# EAGLE schematic CoreExpansion (EAGLE 5.06)
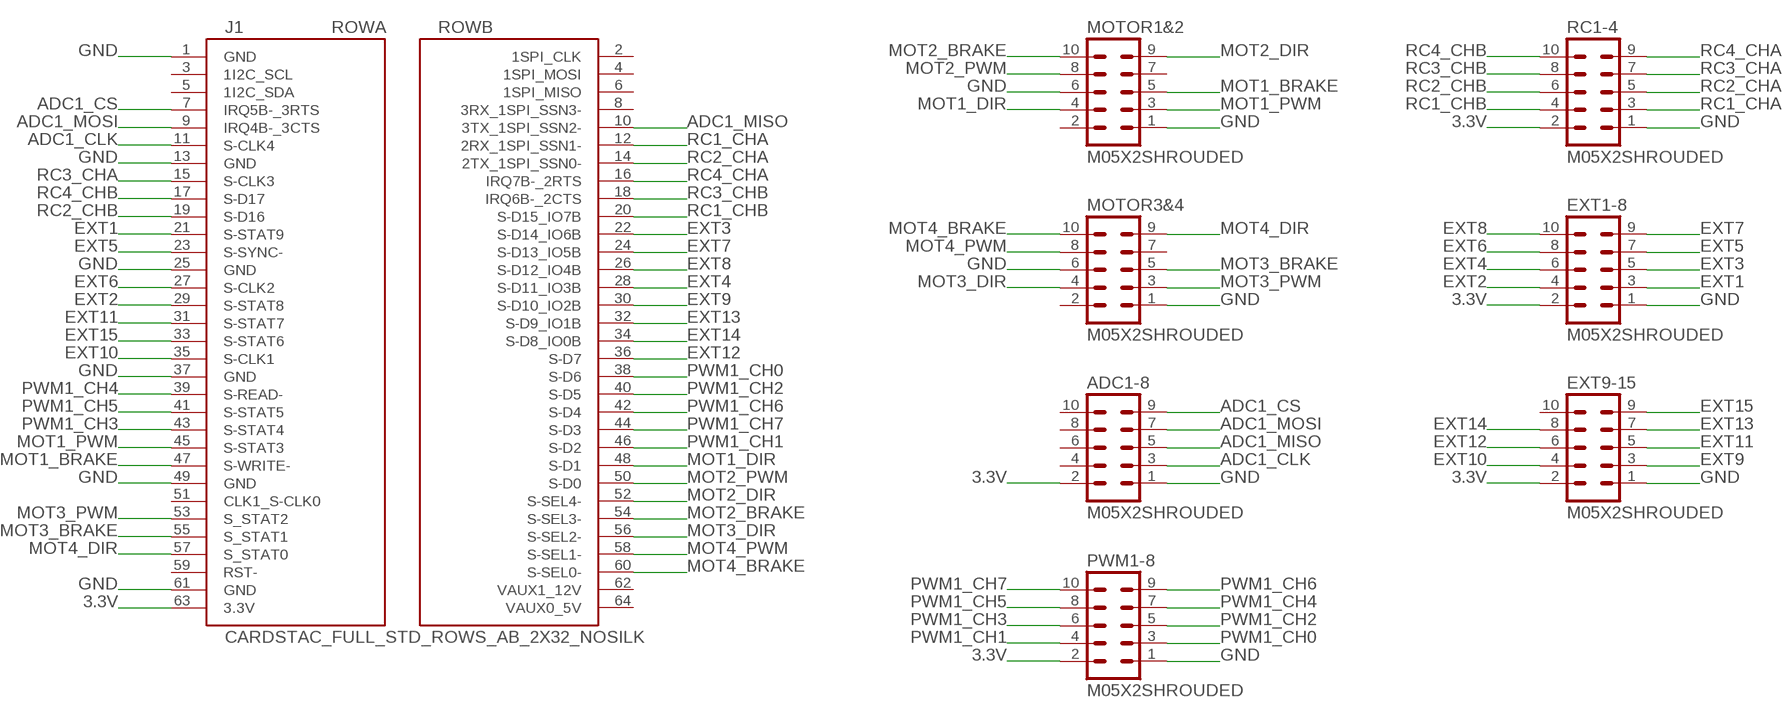
[diagram p0: schematic, sheet 1]

## Parts
ADC1-8  M05X2SHROUDED  [2X05/SHROUDED]
EXT1-8  M05X2SHROUDED  [2X05/SHROUDED]
EXT9-15  M05X2SHROUDED  [2X05/SHROUDED]
J1  CARDSTAC_FULL_STD_ROWS_AB_2X32_NOSILK  [2X32/NOSILK]
MOTOR1&2  M05X2SHROUDED  [2X05/SHROUDED]
MOTOR3&4  M05X2SHROUDED  [2X05/SHROUDED]
PWM1-8  M05X2SHROUDED  [2X05/SHROUDED]
RC1-4  M05X2SHROUDED  [2X05/SHROUDED]

## Nets
3.3V: ADC1-8.2 EXT1-8.2 EXT9-15.2 J1.63(3.3V) PWM1-8.2 RC1-4.2
ADC1_CLK: ADC1-8.3 J1.11(S-CLK4)
ADC1_CS: ADC1-8.9 J1.7(IRQ5B-_3RTS)
ADC1_MISO: ADC1-8.5 J1.10(3TX_1SPI_SSN2-)
ADC1_MOSI: ADC1-8.7 J1.9(IRQ4B-_3CTS)
EXT1: EXT1-8.3 J1.21(S-STAT9)
EXT2: EXT1-8.4 J1.29(S-STAT8)
EXT3: EXT1-8.5 J1.22(S-D14_IO6B)
EXT4: EXT1-8.6 J1.28(S-D11_IO3B)
EXT5: EXT1-8.7 J1.23(S-SYNC-)
EXT6: EXT1-8.8 J1.27(S-CLK2)
EXT7: EXT1-8.9 J1.24(S-D13_IO5B)
EXT8: EXT1-8.10 J1.26(S-D12_IO4B)
EXT9: EXT9-15.3 J1.30(S-D10_IO2B)
EXT10: EXT9-15.4 J1.35(S-CLK1)
EXT11: EXT9-15.5 J1.31(S-STAT7)
EXT12: EXT9-15.6 J1.36(S-D7)
EXT13: EXT9-15.7 J1.32(S-D9_IO1B)
EXT14: EXT9-15.8 J1.34(S-D8_IO0B)
EXT15: EXT9-15.9 J1.33(S-STAT6)
GND: ADC1-8.1 EXT1-8.1 EXT9-15.1 J1.1(GND) J1.13(GND) J1.25(GND) J1.37(GND) J1.49(GND) J1.61(GND) MOTOR1&2.1 MOTOR1&2.6 MOTOR3&4.1 MOTOR3&4.6 PWM1-8.1 RC1-4.1
MOT1_BRAKE: J1.47(S-WRITE-) MOTOR1&2.5
MOT1_DIR: J1.48(S-D1) MOTOR1&2.4
MOT1_PWM: J1.45(S-STAT3) MOTOR1&2.3
MOT2_BRAKE: J1.54(S-SEL3-) MOTOR1&2.10
MOT2_DIR: J1.52(S-SEL4-) MOTOR1&2.9
MOT2_PWM: J1.50(S-D0) MOTOR1&2.8
MOT3_BRAKE: J1.55(S_STAT1) MOTOR3&4.5
MOT3_DIR: J1.56(S-SEL2-) MOTOR3&4.4
MOT3_PWM: J1.53(S_STAT2) MOTOR3&4.3
MOT4_BRAKE: J1.60(S-SEL0-) MOTOR3&4.10
MOT4_DIR: J1.57(S_STAT0) MOTOR3&4.9
MOT4_PWM: J1.58(S-SEL1-) MOTOR3&4.8
PWM1_CH0: J1.38(S-D6) PWM1-8.3
PWM1_CH1: J1.46(S-D2) PWM1-8.4
PWM1_CH2: J1.40(S-D5) PWM1-8.5
PWM1_CH3: J1.43(S-STAT4) PWM1-8.6
PWM1_CH4: J1.39(S-READ-) PWM1-8.7
PWM1_CH5: J1.41(S-STAT5) PWM1-8.8
PWM1_CH6: J1.42(S-D4) PWM1-8.9
PWM1_CH7: J1.44(S-D3) PWM1-8.10
RC1_CHA: J1.12(2RX_1SPI_SSN1-) RC1-4.3
RC1_CHB: J1.20(S-D15_IO7B) RC1-4.4
RC2_CHA: J1.14(2TX_1SPI_SSN0-) RC1-4.5
RC2_CHB: J1.19(S-D16) RC1-4.6
RC3_CHA: J1.15(S-CLK3) RC1-4.7
RC3_CHB: J1.18(IRQ6B-_2CTS) RC1-4.8
RC4_CHA: J1.16(IRQ7B-_2RTS) RC1-4.9
RC4_CHB: J1.17(S-D17) RC1-4.10
Unconnected: ADC1-8.4 ADC1-8.6 ADC1-8.8 ADC1-8.10 EXT9-15.10 J1.2(1SPI_CLK) J1.3(1I2C_SCL) J1.4(1SPI_MOSI) J1.5(1I2C_SDA) J1.6(1SPI_MISO) J1.8(3RX_1SPI_SSN3-) J1.51(CLK1_S-CLK0) J1.59(RST-) MOTOR1&2.2 MOTOR1&2.7 MOTOR3&4.2 MOTOR3&4.7

## Power pins joined to a net without a drawn wire
VAUX0_5V: J1.64(VAUX0_5V)
VAUX1_12V: J1.62(VAUX1_12V)

## Library data of the parts
ADC1-8 EXT1-8 EXT9-15 MOTOR1&2 MOTOR3&4 PWM1-8 RC1-4 = Robot:M05X2: 10-PIN DUAL ROW HEADER Standard 10-pin dual row 0.1" header.
J1 = Robot:CARDSTAC_FULL_STD_ROWS_AB: Rows A and B of the Cardstac specification.